# EAGLE design clock_pulse_test (EAGLE 6.4)
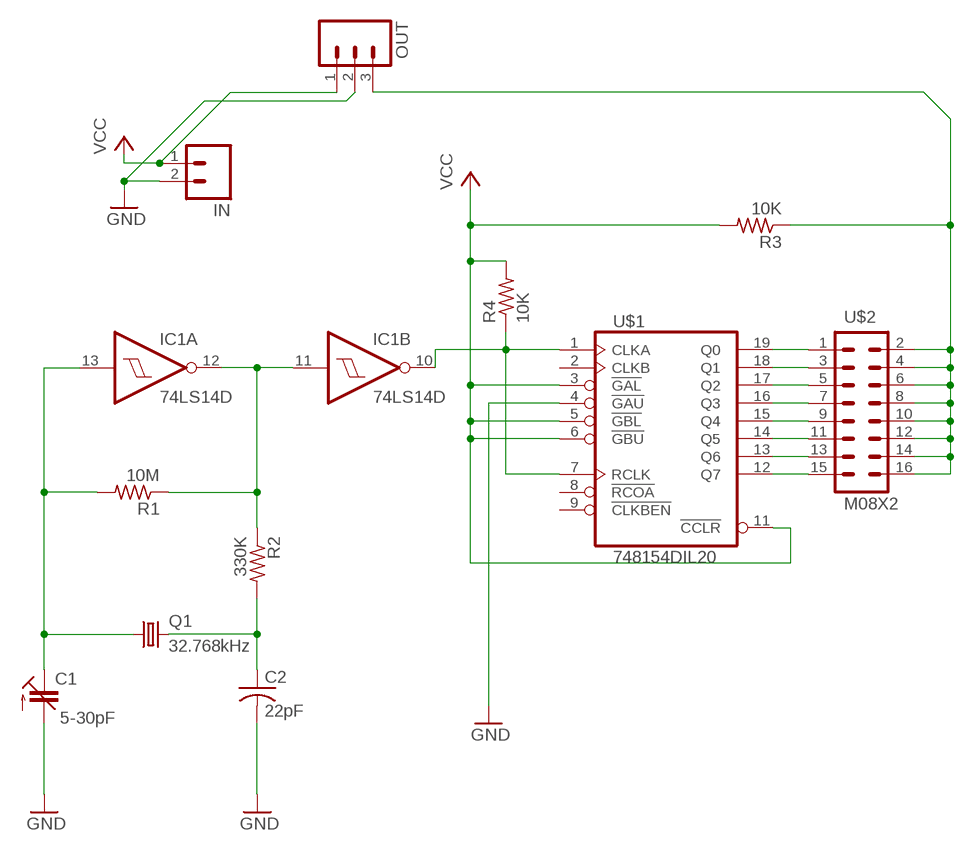
[diagram p0: schematic, sheet 1]

## Parts
C1  5-30pF  C-TRIMMTZ03  [CTRIMTZ03]
C2  22pF  CAPACITOR050-024X044  [C050-024X044]
IC1  74LS14D  [SO14]
IN  M02PTH  [1X02]
OUT  M03PTH  [1X03]
Q1  32.768kHz  CRYSTALTC26V  [TC26V]
R1  10M  RESISTOR0207/10  [0207/10]
R2  330K  RESISTOR0207/10  [0207/10]
R3  10K  RESISTOR0207/10  [0207/10]
R4  10K  RESISTOR0207/10  [0207/10]
U$1  748154DIL20  [DIL20]
U$2  M08X2  [2X8]

## Nets
GND: C1.2(A) C2.2 IN.2 OUT.2 U$1.4(!GAU)
N$1: U$1.19(Q0) U$2.1
N$2: U$1.18(Q1) U$2.3
N$3: U$1.17(Q2) U$2.5
N$4: U$1.16(Q3) U$2.7
N$5: U$1.15(Q4) U$2.9
N$6: U$1.14(Q5) U$2.11
N$7: U$1.13(Q6) U$2.13
N$8: U$1.12(Q7) U$2.15
N$11: C1.1(E) IC1.13(A:I) Q1.1 R1.2
N$12: C2.1 Q1.2 R2.2
N$13: IC1.11(B:I) IC1.12(A:O) R1.1 R2.1
N$14: IC1.10(B:O) R4.1 U$1.1(CLKA) U$1.7(RCLK)
N$16: OUT.3 R3.1 U$2.2 U$2.4 U$2.6 U$2.8 U$2.10 U$2.12 U$2.14 U$2.16
VCC: IN.1 OUT.1 R3.2 R4.2 U$1.3(!GAL) U$1.5(!GBL) U$1.6(!GBU) U$1.11(!CCLR)
Unconnected: IC1.1(D:I) IC1.2(D:O) IC1.3(E:I) IC1.4(E:O) IC1.5(F:I) IC1.6(F:O) IC1.8(C:O) IC1.9(C:I) U$1.2(CLKB) U$1.8(!RCOA) U$1.9(!CLKBEN)

## Power pins joined to a net without a drawn wire
GND: IC1.7(P:GND) U$1.10(GND)
VCC: IC1.14(P:VCC) U$1.20(VCC)

## Library data of the parts
C1 = iStivi - RCLD:C-TRIMM: Trimm capacitor
C2 = iStivi - RCLD:CAPACITOR: CAPACITOR, American symbol
IC1 = iStivi - ICs:74*14: Hex schmitt trigger INVERTER
IN = iStivi - Header-Connector:M02: Header 2 Standard 2-pin 0.1" header. Use with straight break away headers (SKU : PRT-00116), right angle break away headers (PRT-00553), swiss pins (PRT-00743), machine pins (PRT-00117), and female headers (PRT-00115). Molex polarized connector foot print use with SKU : PRT-08233 with associated crimp pins and housings.
OUT = iStivi - Header-Connector:M03: Header 3 Standard 3-pin 0.1" header. Use with straight break away headers (SKU : PRT-00116), right angle break away headers (PRT-00553), swiss pins (PRT-00743), machine pins (PRT-00117), and female headers (PRT-00115). Molex polarized connector foot print use with SKU : PRT-08232 with associated crimp pins and housings.
Q1 = iStivi - Oscillators:CRYSTAL: CRYSTAL; OC_FARNELL: unknown; OC_NEWARK: unknown
R1-R4 = iStivi - RCLD:RESISTOR: RESISTOR
U$1 = iStivi - ICs:74*8154: 16-bit binary counter Dual 16-bit binary counter with 3-state output register
U$2 = iStivi - Header-Connector:M08X2: .1" headers, two rows of 8 each

## Board
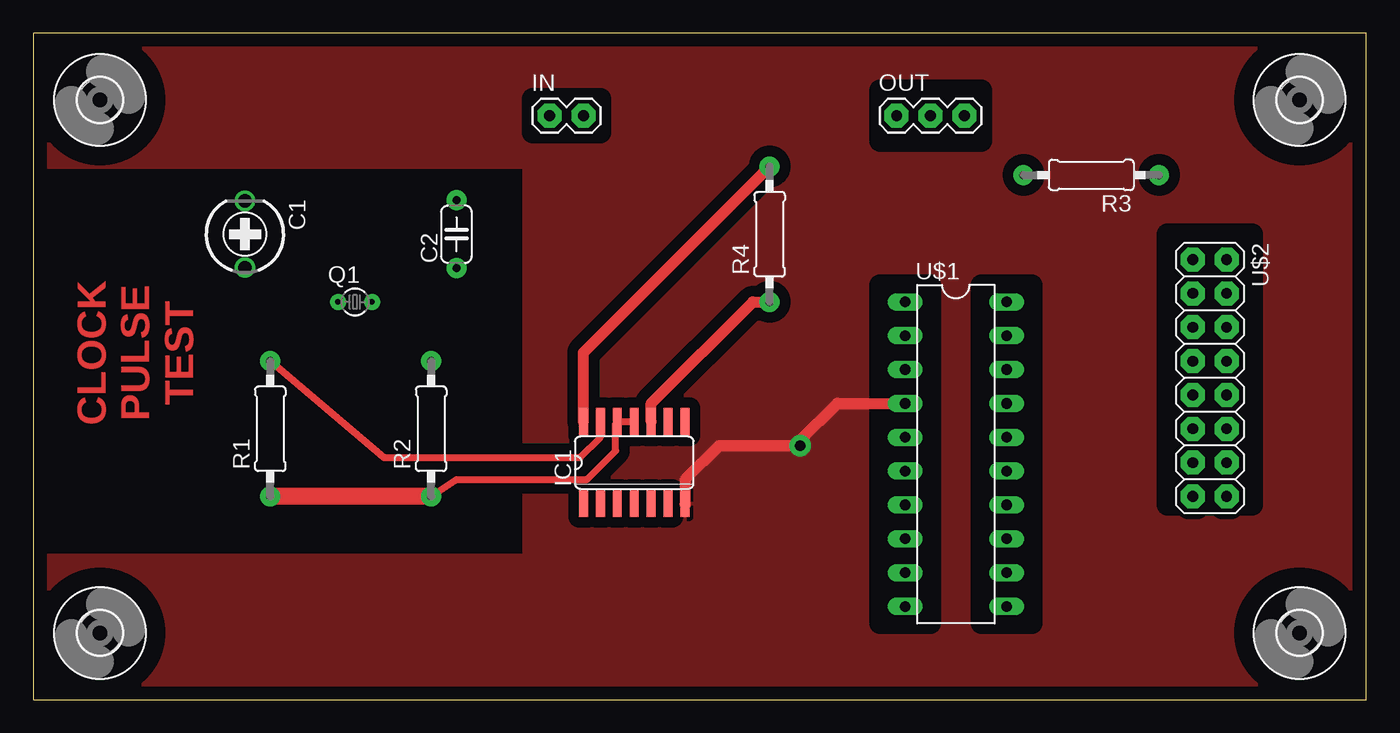
[diagram p1: board, top side]
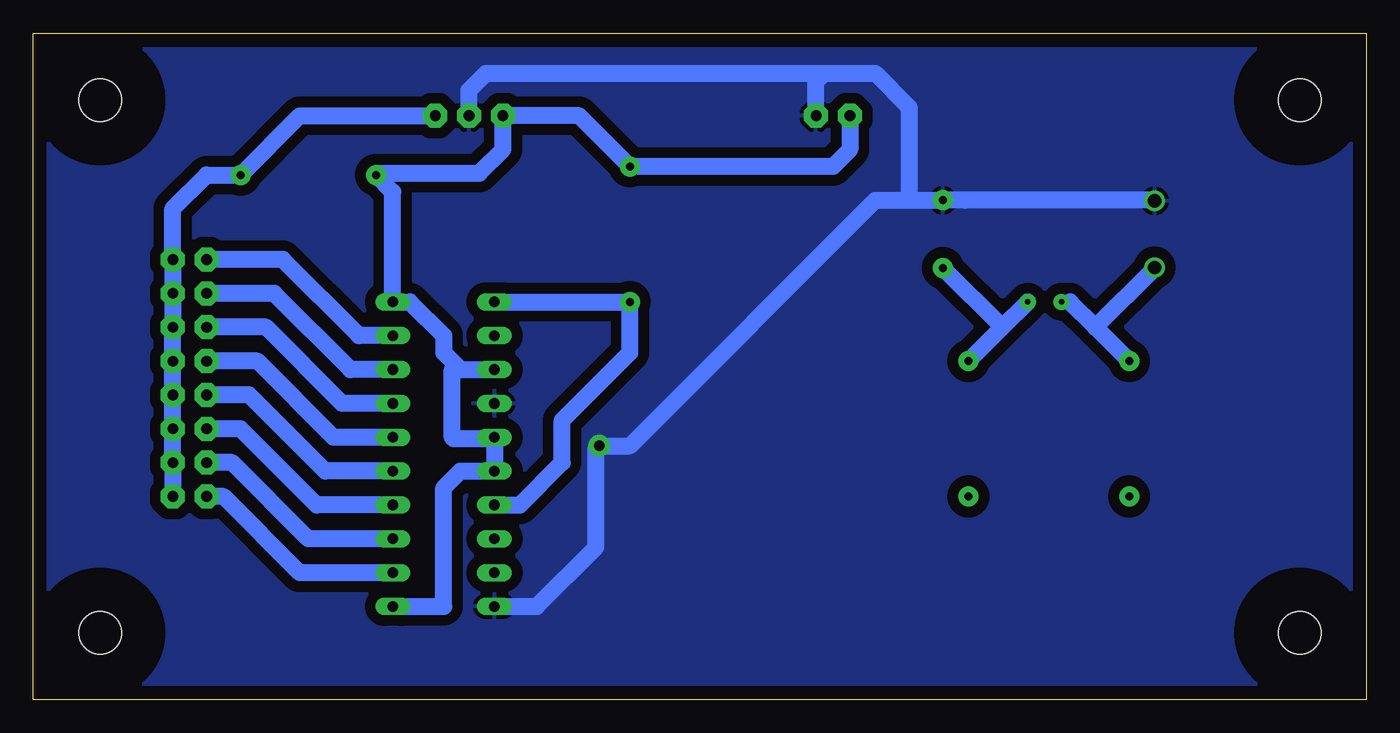
[diagram p2: board, bottom side, seen from below]

Size 100 x 50 mm. Coordinates in mm from the lower left corner, seen from the top.
Outline: 0,0 100,0 100,50 0,50 0,0
Copper layers (1*16): Top 0.035mm / dielectric 1.5mm / Bottom 0.035mm
Design rules "iStivi-0.8mm via-20mil-track": minimum track width 20mil, minimum drill 0.8mm, track to track 20mil, track to pad 20mil, pad to pad 10mil, via to via 20mil, smd to smd 10mil, copper to edge 40mil, drill to drill 8mil, minimum pad ring 10mil, minimum via ring 16mil, stop-mask expansion 0mil, vias tented up to drill 0mil, thermal gap 12mil
tRestrict: area 63.5,5.7 to 67.3,31.1; area 71.1,5.7 to 74.9,31.1; area 14.6,36.2 to 17.1,38.7; area 14.6,31.1 to 17.1,33.7; area 22.2,29.2 to 26,30.5; area 37.5,42.5 to 42.5,45.1; area 63.5,41.9 to 71.1,45.7; area 85.1,14.6 to 91.4,34.9

### Footprints (pad centres in the part's own frame; a part is rotated, then mirrored left to right if it is on the bottom)
CTRIMTZ03 = drill 1: 1 0,2.5; 2 0,-2.5
C050-024X044 = drill 0.6 pad 1.5: 1 -2.54,0; 2 2.54,0
SO14 = smd 0.66 x 2.032: 1 -3.81,-3.073; 2 -2.54,-3.073; 3 -1.27,-3.073; 4 0,-3.073; 5 1.27,-3.073; 6 2.54,-3.073; 7 3.81,-3.073; 8 3.81,3.073; 9 2.54,3.073; 10 1.27,3.073; 11 0,3.073; 12 -1.27,3.073; 13 -2.54,3.073; 14 -3.81,3.073
1X02 = drill 0.8 pad 1.8 octagon: 1 0,0; 2 2.54,0
1X03 = drill 0.8 pad 1.8 octagon: 1 0,0; 2 2.54,0; 3 5.08,0
TC26V = drill 0.4 pad 1.2: 1 -1.27,0; 2 1.27,0
0207/10 = drill 0.6 pad 1.5: 1 -5.08,0; 2 5.08,0
DIL20 = drill 0.8 long: 1 -11.43,-3.81; 2 -8.89,-3.81; 3 -6.35,-3.81; 4 -3.81,-3.81; 5 -1.27,-3.81; 6 1.27,-3.81; 7 3.81,-3.81; 8 6.35,-3.81; 9 8.89,-3.81; 10 11.43,-3.81; 11 11.43,3.81; 12 8.89,3.81; 13 6.35,3.81; 14 3.81,3.81; 15 1.27,3.81; 16 -1.27,3.81; 17 -3.81,3.81; 18 -6.35,3.81; 19 -8.89,3.81; 20 -11.43,3.81
2X8 = drill 0.8 pad 1.8 octagon: 1 0,0; 2 0,2.54; 3 2.54,0; 4 2.54,2.54; 5 5.08,0; 6 5.08,2.54; 7 7.62,0; 8 7.62,2.54; 9 10.16,0; 10 10.16,2.54; 11 12.7,0; 12 12.7,2.54; 13 15.24,0; 14 15.24,2.54; 15 17.78,0; 16 17.78,2.54
3,2 = hole 3.2: 0,0

### Placement (x,y rotation side)
C1  15.88,34.92 180 top
C2  31.75,34.92 90 top
IC1  45.09,17.78 0 top
IN  38.73,43.81 0 top
OUT  64.77,43.81 0 top
Q1  24.13,29.84 0 top
R1  17.78,20.32 90 top
R2  29.84,20.32 90 top
R3  79.38,39.37 180 top
R4  55.24,34.92 90 top
U$1  69.22,18.41 270 top
U$2  87,33.02 270 top
U$3  [3,2]  5,45 0 top
U$4  [3,2]  5,5 0 top
U$5  [3,2]  95,5 0 top
U$6  [3,2]  95,45 0 top

### Tracks (layer width: path | path; a pad name or v marks a point on that pad's centre or on a via)
GND  (via drill 0.8)
  Top 0.813: U$1.4 60.33,22.23 57.53,19.43 v57.53,19.05 51.44,19.05 48.9,16.51 IC1.7 48.9,14.61
  Bottom 0.508: 15.88,37.47 C1.2 | 30.1,37.59 30.1,37.47
  Bottom 1.27: 15.88,37.47 30.1,37.47 C2.2 34.29,37.47 | U$1.10 62.23,6.99 57.78,11.43 57.78,18.8 v57.53,19.05 55.24,19.05 36.83,37.47 34.29,37.47 | IN.2 41.27,46.35 40.64,46.99 | 40.64,46.99 36.83,46.99 34.29,44.45 34.29,37.47 | OUT.2 67.31,45.72 66.04,46.99 40.64,46.99
  pour Bottom (isolate 0.813): 0,0 99.69,0 99.69,50.16 0,50.16
  pour Top (isolate 0.813): 0,0 99.69,0 99.69,50.16 0,50.16 0,40.01 36.83,40.01 36.83,10.79 0,10.79
N$1
  Bottom 1.27: U$1.19 75.56,27.3 81.28,33.02 U$2.1
N$2
  Bottom 1.27: U$1.18 76.2,24.77 81.92,30.48 U$2.3
N$3
  Bottom 1.27: U$1.17 76.83,22.23 82.55,27.94 U$2.5
N$4
  Bottom 1.27: U$1.16 77.47,19.68 83.19,25.4 U$2.7
N$5
  Bottom 1.27: U$1.15 78.11,17.14 83.82,22.86 U$2.9
N$6
  Bottom 1.27: U$1.14 78.74,14.61 84.45,20.32 U$2.11
N$7
  Bottom 1.27: U$1.13 79.38,12.06 85.09,17.78 U$2.13
N$8
  Bottom 1.27: U$1.12 80.01,9.53 85.72,15.24 U$2.15
N$11
  Top 0.508: IC1.13 42.55,19.68 41.02,18.16 26.29,18.16 R1.2
  Bottom 0.508: 22.23,29.84 Q1.1 | 15.88,32.38 C1.1
  Bottom 1.27: R1.2 20.32,27.94 | 20.32,27.94 22.23,29.84 | 20.32,27.94 15.88,32.38
N$12
  Bottom 1.27: R2.2 27.3,27.94 | 27.3,27.94 Q1.2 | 27.3,27.94 C2.1
N$13
  Top 0.508: IC1.11 45.09,20.83 43.81,20.83 IC1.12 43.69,20.7 43.69,18.67 41.53,16.51 31.75,16.51 R2.1
  Top 1.27: R2.1 R1.1
N$14
  Top 0.813: IC1.10 46.35,22.23 53.98,29.84 R4.1
  Bottom 1.27: U$1.1 R4.1 55.24,26.04 60.33,20.95 60.33,17.78 63.5,14.61 U$1.7
N$16
  Bottom 1.27: U$2.16 U$2.14 U$2.12 U$2.10 U$2.8 U$2.6 U$2.4 U$2.2 89.53,36.83 87,39.37 R3.1 80.01,43.81 OUT.3
VCC
  Top 0.813: IC1.14 41.27,26.04 R4.2
  Bottom 0.508: 65.15,24.77 U$1.3 65.53,24.64 | 74.17,39.5 R3.2
  Bottom 1.27: IN.1 38.73,41.27 40.01,40.01 R4.2 59.05,43.81 OUT.1 64.77,41.27 66.55,39.5 74.17,39.5 | R3.2 73.03,38.1 U$1.20 71.75,29.84 69.22,27.3 69.22,26.04 68.26,25.08 | 68.26,25.08 67.94,24.77 U$1.3 | 65.28,19.56 65.41,19.56 | 65.41,19.56 68.45,19.56 68.58,19.68 68.58,24.77 68.26,25.08 | U$1.5 65.41,19.56 | 65.41,19.56 U$1.6 67.94,17.14 69.22,15.88 69.22,6.99 U$1.11

### Text on the board
Top: CLOCK / PULSE / TEST